# EAGLE design lcd (EAGLE 5.12)
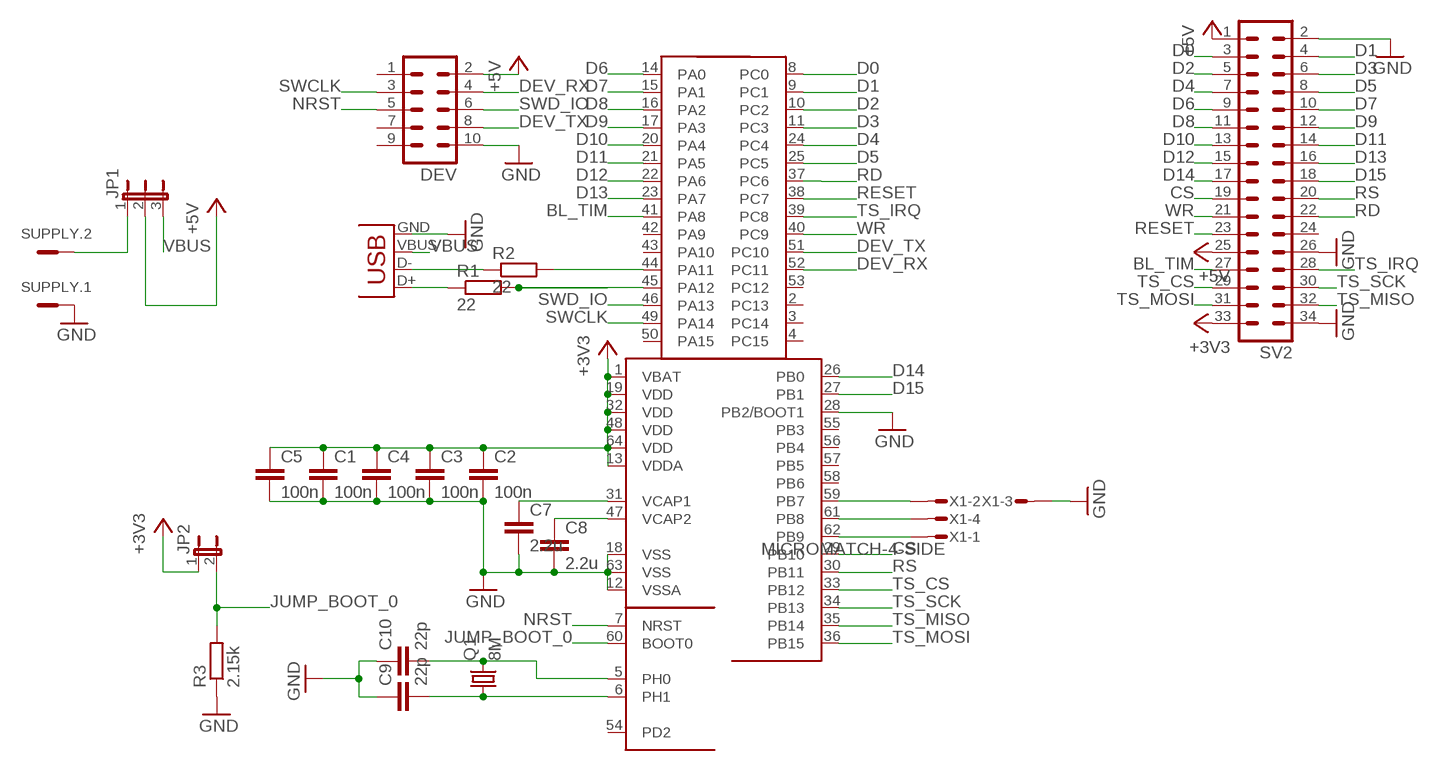
[diagram p0: schematic, sheet 1]

## Parts
C1  100n  C-EUC0603  [C0603]
C2  100n  C-EUC0603  [C0603]
C3  100n  C-EUC0603  [C0603]
C4  100n  C-EUC0603  [C0603]
C5  100n  C-EUC0603  [C0603]
C7  2.2u  C-EUC0603  [C0603]
C8  2.2u  C-EUC0603  [C0603]
C9  22p  C-EUC0603  [C0603]
C10  22p  C-EUC0603  [C0603]
DEV  ML10L  [ML10L]
JP1  JP2E  [JP2]
JP2  JP1E  [JP1]
Q1  8M  QUARTZABM7  [ABM7]
R1  22  R-EU_R0603  [R0603]
R2  22  R-EU_R0603  [R0603]
R3  2.15k  R-EU_R0603  [R0603]
SUPPLY  MC2  [MC2]
SV2  MA17-2  [MA17-2]
U1  STM32F4-64-8MIL  [SQFP-S-10X10-64-8MIL]
X1  MICROMATCH-4-SIDE  [MICROMATCH-4-SIDE]
X2  USB-MICROB-S  [USB-MICROB]

## Nets
+3V3: C1.1 C2.1 C3.1 C4.1 C5.1 JP2.1 SV2.33 U1.1(VBAT) U1.13(VDDA) U1.19(VDD) U1.32(VDD) U1.48(VDD) U1.64(VDD)
+5V: DEV.2 JP1.2 SV2.1 SV2.25
BL_TIM: SV2.27 U1.41(PA8)
CS: SV2.19 U1.29(PB10)
D0: SV2.3 U1.8(PC0)
D1: SV2.4 U1.9(PC1)
D2: SV2.5 U1.10(PC2)
D3: SV2.6 U1.11(PC3)
D4: SV2.7 U1.24(PC4)
D5: SV2.8 U1.25(PC5)
D6: SV2.9 U1.14(PA0)
D7: SV2.10 U1.15(PA1)
D8: SV2.11 U1.16(PA2)
D9: SV2.12 U1.17(PA3)
D10: SV2.13 U1.20(PA4)
D11: SV2.14 U1.21(PA5)
D12: SV2.15 U1.22(PA6)
D13: SV2.16 U1.23(PA7)
D14: SV2.17 U1.26(PB0)
D15: SV2.18 U1.27(PB1)
DEV_RX: DEV.4 U1.52(PC11)
DEV_TX: DEV.8 U1.51(PC10)
GND: C1.2 C2.2 C3.2 C4.2 C5.2 C7.2 C8.2 C9.1 C10.1 DEV.10 R3.1 SUPPLY.1 SV2.2 SV2.26 SV2.34 U1.12(VSSA) U1.18(VSS) U1.28(PB2/BOOT1) U1.63(VSS) X1.3 X2.GND
JUMP_BOOT_0: JP2.2 R3.2 U1.60(BOOT0)
N$1: U1.62(PB9) X1.1
N$2: C7.1 U1.31(VCAP1)
N$3: C8.1 U1.47(VCAP2)
N$4: C10.2 Q1.2 U1.5(PH0)
N$5: C9.2 Q1.1 U1.6(PH1)
N$6: U1.61(PB8) X1.4
N$7: U1.59(PB7) X1.2
N$8: R1.1 X2.D+
N$9: R2.1 X2.D-
N$10: JP1.1 SUPPLY.2
NRST: DEV.5 U1.7(NRST)
RD: SV2.22 U1.37(PC6)
RESET: SV2.23 U1.38(PC7)
RS: SV2.20 U1.30(PB11)
SWCLK: DEV.3 U1.49(PA14)
SWD_IO: DEV.6 U1.46(PA13)
TS_CS: SV2.29 U1.33(PB12)
TS_IRQ: SV2.28 U1.39(PC8)
TS_MISO: SV2.32 U1.35(PB14)
TS_MOSI: SV2.31 U1.36(PB15)
TS_SCK: SV2.30 U1.34(PB13)
USB_DM: R2.2 U1.44(PA11)
USB_DP: R1.2 U1.45(PA12)
VBUS: JP1.3 X2.VBUS
WR: SV2.21 U1.40(PC9)
Unconnected: DEV.1 DEV.7 DEV.9 SV2.24 U1.2(PC13) U1.3(PC14) U1.4(PC15) U1.42(PA9) U1.43(PA10) U1.50(PA15) U1.53(PC12) U1.54(PD2) U1.55(PB3) U1.56(PB4) U1.57(PB5) U1.58(PB6)

## Library data of the parts
C1-C5 C7-C10 = rcl:C-EU: CAPACITOR, European symbol
DEV = con-harting-ml:ML10: HARTING
JP1 = jumper:JP2E: JUMPER
JP2 = jumper:JP1E: JUMPER
Q1 = ni-crystal:QUARTZ
R1-R3 = rcl:R-EU_: RESISTOR, European symbol
SUPPLY = con-phoenix-381_l:MC2: Mini-Combicon 3.81mm horizontal 2-polig MC 1,5/2-G-3,81 Artikel-Nr. 1803277
SV2 = con-lstb:MA17-2: PIN HEADER
U1 = apbteam_stm32:STM32F4-64: STM32F4, 64 pin package According to STM32F40x datasheet, compatible with STM32F4xx, STM32F2xx. Also compatible with STM32F10x, if VCAP1 and VCAP2 are connected directly to VSS.
X1 = apbteam_con-amp-micromatch:MICROMATCH-4: MicroMaTch 4
X2 = apbteam_con-usb:USB: USB Connectors

## Board
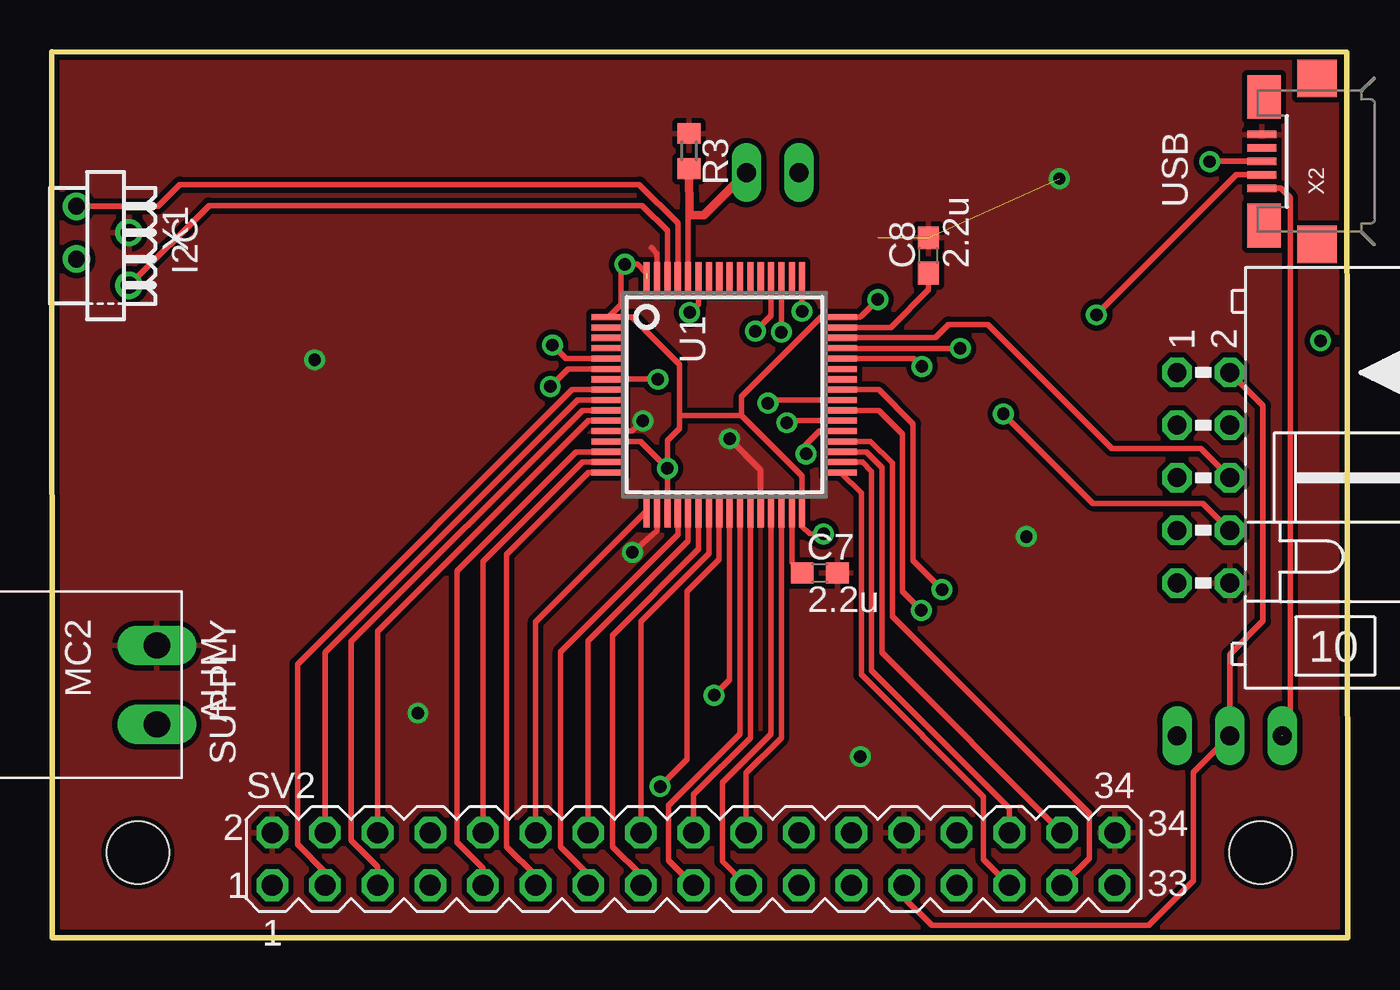
[diagram p1: board, top side]
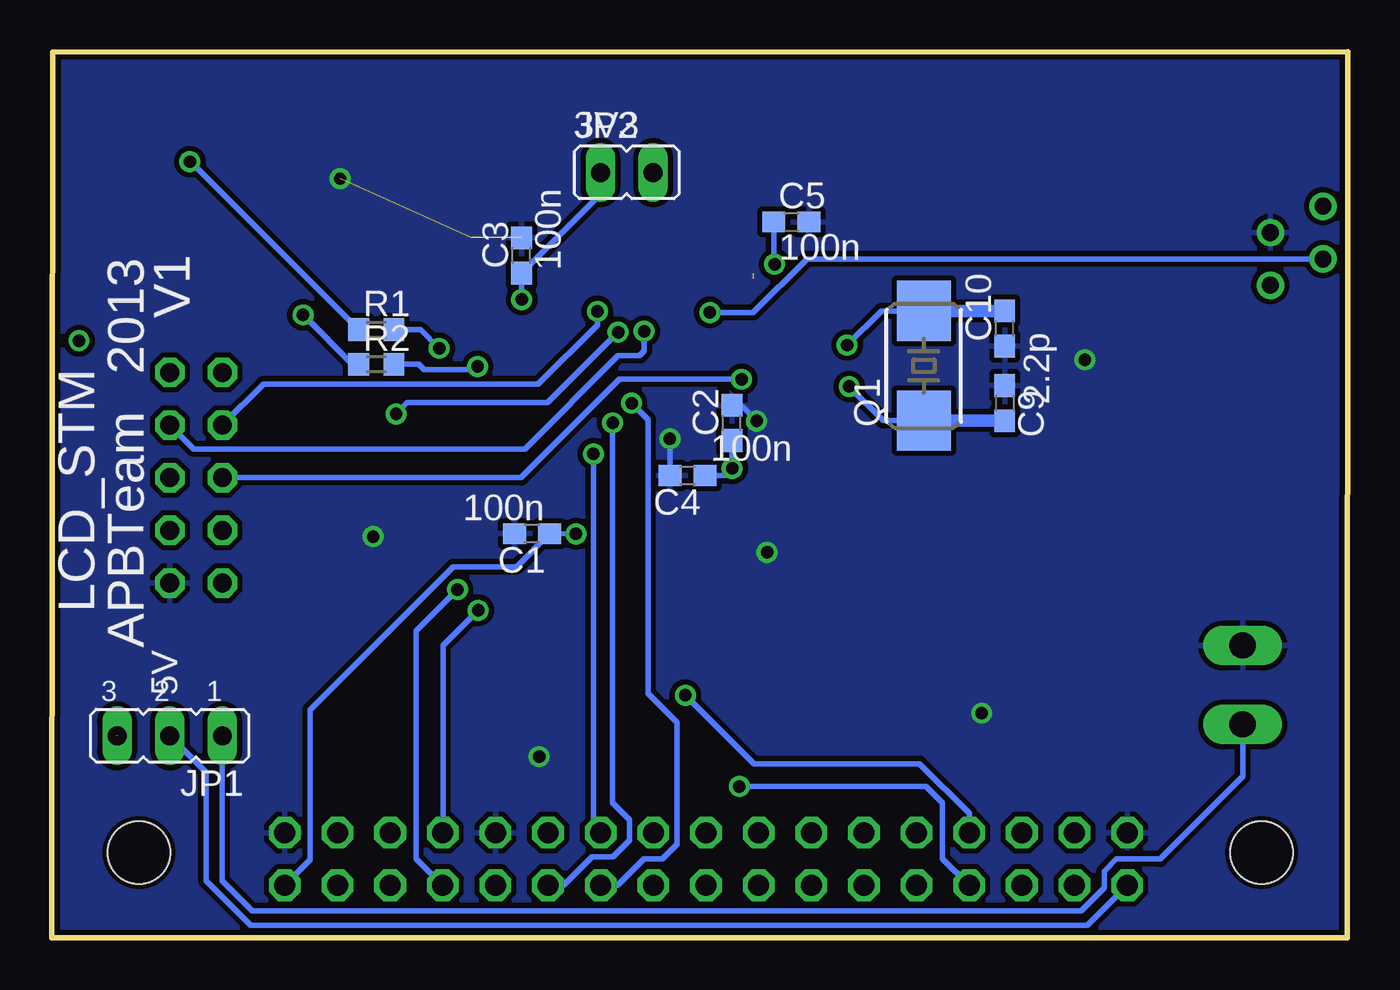
[diagram p2: board, bottom side, seen from below]

Size 62.52 x 42.76 mm. Coordinates in mm from the lower left corner, seen from the top.
Outline: 62.52,0.01 0.03,0 0,42.76 62.47,42.75 62.52,0.01
Copper layers (1*16): Top 0.035mm / dielectric 1.5mm / Bottom 0.035mm
Design rules "Dipole-electronique": minimum track width 0.2mm, minimum drill 0.5mm, track to track 0.2mm, track to pad 0.2mm, pad to pad 0.2mm, via to via 0.2mm, smd to smd 0.2mm, copper to edge 0.2mm, drill to drill 8mil, minimum pad ring 10mil, minimum via ring 8mil, stop-mask expansion 4mil, vias tented up to drill 0mil, thermal gap 10mil
Holes 3 mm at 4.16,4.12 58.32,4.12

### Footprints (pad centres in the part's own frame; a part is rotated, then mirrored left to right if it is on the bottom)
C0603 = smd 1.1 x 1: 1 -0.85,0; 2 0.85,0
ML10L = drill 0.914 octagon: 1 -5.08,-1.27; 2 -5.08,1.27; 3 -2.54,-1.27; 4 -2.54,1.27; 5 0,-1.27; 6 0,1.27; 7 2.54,-1.27; 8 2.54,1.27; 9 5.08,-1.27; 10 5.08,1.27
JP2 = drill 0.914 long: 1 -2.54,0; 2 0,0; 3 2.54,0
JP1 = drill 0.914 long: 1 0,-1.27; 2 0,1.27
ABM7 = smd 2.9 x 2.6: 1 -2.65,0; 2 2.65,0
R0603 = smd 1 x 1.1: 1 -0.85,0; 2 0.85,0
MC2 = drill 1.27 long: 1 -1.905,0; 2 1.905,0
MA17-2 = drill 1.016 octagon: 1 -20.32,-1.27; 2 -20.32,1.27; 3 -17.78,-1.27; 4 -17.78,1.27; 5 -15.24,-1.27; 6 -15.24,1.27; 7 -12.7,-1.27; 8 -12.7,1.27; 9 -10.16,-1.27; 10 -10.16,1.27; 11 -7.62,-1.27; 12 -7.62,1.27; 13 -5.08,-1.27; 14 -5.08,1.27; 15 -2.54,-1.27; 16 -2.54,1.27; 17 0,-1.27; 18 0,1.27; 19 2.54,-1.27; 20 2.54,1.27; 21 5.08,-1.27; 22 5.08,1.27; 23 7.62,-1.27; 24 7.62,1.27; 25 10.16,-1.27; 26 10.16,1.27; 27 12.7,-1.27; 28 12.7,1.27; 29 15.24,-1.27; 30 15.24,1.27; 31 17.78,-1.27; 32 17.78,1.27; 33 20.32,-1.27; 34 20.32,1.27
SQFP-S-10X10-64-8MIL = smd 0.295 x 1.6: 1 -3.75,-5.6; 2 -3.25,-5.6; 3 -2.75,-5.6; 4 -2.25,-5.6; 5 -1.75,-5.6; 6 -1.25,-5.6; 7 -0.75,-5.6; 8 -0.25,-5.6; 9 0.25,-5.6; 10 0.75,-5.6; 11 1.25,-5.6; 12 1.75,-5.6; 13 2.25,-5.6; 14 2.75,-5.6; 15 3.25,-5.6; 16 3.75,-5.6; 33 3.75,5.6; 34 3.25,5.6; 35 2.75,5.6; 36 2.25,5.6; 37 1.75,5.6; 38 1.25,5.6; 39 0.75,5.6; 40 0.25,5.6; 41 -0.25,5.6; 42 -0.75,5.6; 43 -1.25,5.6; 44 -1.75,5.6; 45 -2.25,5.6; 46 -2.75,5.6; 47 -3.25,5.6; 48 -3.75,5.6 | smd 1.6 x 0.295: 17 5.6,-3.75; 18 5.6,-3.25; 19 5.6,-2.75; 20 5.6,-2.25; 21 5.6,-1.75; 22 5.6,-1.25; 23 5.6,-0.75; 24 5.6,-0.25; 25 5.6,0.25; 26 5.6,0.75; 27 5.6,1.25; 28 5.6,1.75; 29 5.6,2.25; 30 5.6,2.75; 31 5.6,3.25; 32 5.6,3.75; 49 -5.6,3.75; 50 -5.6,3.25; 51 -5.6,2.75; 52 -5.6,2.25; 53 -5.6,1.75; 54 -5.6,1.25; 55 -5.6,0.75; 56 -5.6,0.25; 57 -5.6,-0.25; 58 -5.6,-0.75; 59 -5.6,-1.25; 60 -5.6,-1.75; 61 -5.6,-2.25; 62 -5.6,-2.75; 63 -5.6,-3.25; 64 -5.6,-3.75
MICROMATCH-4-SIDE = drill 0.813 round: 1 1.905,1.27; 2 0.635,-1.27; 3 -0.635,1.27; 4 -1.905,-1.27
USB-MICROB = smd 0.35 x 1.4: D+ 0,2.65; D- -0.65,2.65; GND 1.3,2.65; ID 0.65,2.65; VBUS -1.3,2.65 | smd 1.8 x 1.9: MT1 -4,0; MT2 4,0 | smd 2.1 x 1.6: MT3 -3.1,2.55; MT4 3.1,2.55

### Placement (x,y rotation side)
C1  39.35,19.51 180 bottom
C2  29.71,24.85 90 bottom
C3  39.86,32.93 90 bottom
C4  31.85,22.31 180 bottom
C5  26.84,34.55 0 bottom
C7  37.05,17.61 0 top
C8  42.3,32.93 90 top
C9  16.55,25.81 270 bottom
C10  16.55,29.41 90 bottom
DEV  55.56,22.21 270 top
JP1  56.83,9.76 180 bottom
JP2  34.78,36.94 270 bottom
Q1  20.45,27.61 90 bottom
R1  46.87,29.35 0 bottom
R2  46.87,27.68 0 bottom
R3  30.74,37.97 270 top
SUPPLY  5.07,12.21 270 top
SV2  30.96,3.81 0 top
U1  32.45,26.21 270 top
X1  2.46,33.4 270 top
X2  61.04,37.47 90 top

### Tracks (layer width: path | path; a pad name or v marks a point on that pad's centre or on a via)
+3V3  (via drill 0.6)  (1 unrouted)
  Top 0.254: 28.7,32.06 28.25,32.51 v27.65,32.51 27.45,32.51 27.45,30.56 U1.1 | U1.1 26.6,29.96 | 39.05,30.01 v39.85,30.81 39,29.96 U1.48 37.11,29.95 33.28,26.12 33.28,25.21 | U1.19 v29.7,22.66 | v37.23,19.5 36.55,19.51 36.2,19.86 U1.32 36.2,22.29 33.28,25.21 | U1.13 28.4,23.96 v29.7,22.66 | v29.7,22.66 C2.1 30.29,24.59 30.29,25.21 | 30.29,25.21 30.29,27.67 28,29.96 U1.1 | 30.29,25.21 33.28,25.21
  Bottom 0.254: SV2.33 50.05,3.77 50.05,11.01 43.15,17.91 40.1,17.91 C1.1 v37.23,19.5 | v27.65,32.51 27.69,32.55 C5.1 | v39.85,30.81 v39.86,30.82 C3.1 36.05,35.89 JP2.1 | C2.1 29.7,24.31 v29.7,22.66 30.05,22.31 C4.1
+5V
  Top 0.254: SV2.25 41.12,1.94 42.45,0.61 52.93,0.61 55.07,2.75 55.07,8 JP1.2 56.83,13.69 58.43,15.29 58.43,25.69 DEV.2
  Bottom 0.254: SV2.1 12.57,0.61 52.93,0.61 55.07,2.75 55.07,8 JP1.2
BL_TIM  (via drill 0.6)
  Top 0.254: U1.41 39.9,26.46 41.55,24.81 41.55,18.21 v42.95,16.81
  Bottom 0.254: SV2.27 44.95,3.83 44.95,14.81 v42.95,16.81
CS
  Top 0.254: SV2.19 32.35,3.69 32.35,7.51 34.7,9.86 U1.29
D0
  Top 0.254: SV2.3 13.18,3.18 11.85,4.51 11.85,13.21 25.1,26.46 U1.8
D1
  Top 0.254: SV2.4 13.18,13.78 25.36,25.96 U1.9
D2
  Top 0.254: SV2.5 15.72,3.44 14.45,4.71 14.45,14.31 25.6,25.46 U1.10
D3
  Top 0.254: SV2.6 15.72,14.78 25.9,24.96 U1.11
D4  (via drill 0.6)
  Top 0.254: v29.35,7.31 30.65,8.61 30.65,16.71 32.2,18.26 U1.24
  Bottom 0.254: SV2.7 19.55,3.83 19.55,6.51 20.35,7.31 v29.35,7.31
D5  (via drill 0.6)
  Top 0.254: v31.95,11.71 32.7,12.46 U1.25
  Bottom 0.254: SV2.8 18.26,6.02 20.65,8.41 28.65,8.41 v31.95,11.71
D6
  Top 0.254: SV2.9 20.8,3.36 19.55,4.61 19.55,17.71 25.3,23.46 U1.14
D7
  Top 0.254: SV2.10 20.8,18.16 25.6,22.96 U1.15
D8
  Top 0.254: SV2.11 23.34,3.02 21.95,4.41 21.95,18.51 25.9,22.46 U1.16
D9
  Top 0.254: SV2.12 23.34,15.25 U1.17
D10
  Top 0.254: SV2.13 25.88,3.08 24.55,4.41 24.55,13.81 30.2,19.46 U1.20
D11
  Top 0.254: SV2.14 25.88,14.34 30.7,19.16 U1.21
D12
  Top 0.254: SV2.15 28.42,3.04 27.05,4.41 27.05,14.61 31.2,18.76 U1.22
D13
  Top 0.254: SV2.16 28.42,15.28 31.7,18.56 U1.23
D14
  Top 0.254: SV2.17 29.75,3.75 29.75,6.41 33.2,9.86 U1.26
D15
  Top 0.254: SV2.18 30.96,6.92 33.7,9.66 U1.27
DEV_RX  (via drill 0.6)
  Top 0.254: U1.52 34.7,30.04 v33.94,29.28
  Bottom 0.254: v33.94,29.28 33.94,28.32 34.16,28.1 35.2,28.1 39.7,23.6 55.68,23.6 DEV.4
DEV_TX  (via drill 0.6)
  Top 0.254: v35.2,29.23 U1.51 | v45.91,25.29 50.23,20.97 55.53,20.97 DEV.8
  Bottom 0.254: v35.2,29.23 38.6,25.83 45.37,25.83 v45.91,25.29
GND  (via drill 0.6)  (2 unrouted)
  Top 0.254: U1.28 34.2,22.59 v32.7,24.09 | U1.63 29.2,33.03 28.93,33.3 | U1.12 28,24.46 v28.52,24.95 | U1.18 29.2,19.66 v28.01,18.61
  Bottom 0.254: C4.2 v32.7,24.09 | v28.52,24.95 29.24,25.7 C2.2
  other vias: 12.68,27.9 17.66,10.85 39.01,8.75 47.02,19.37 48.61,36.64
  pour Bottom (isolate 0.254): 62.45,42.72 -0.01,42.79 0.05,0.01 62.47,0.04
  pour Top (isolate 0.254): 62.45,-0.01 0.05,0.01 0,42.79 62.48,42.76
JUMP_BOOT_0
  Top 0.254: R3.2 30.7,34.88 U1.60
  Top 0.406: R3.2 30.77,34.88 31.45,34.88 JP2.2
N$1
  Top 0.254: U1.62 29.7,34.13 28.48,35.34 7.58,35.34 X1.1
N$2
  Top 0.254: C7.1 35.7,18.11 U1.31
N$3
  Top 0.254: C8.1 42.3,31.28 40.48,29.46 U1.47
N$4  (via drill 0.6)
  Top 0.254: 24.75,28.01 v24.15,28.61 24.8,27.96 U1.5
  Bottom 0.254: Q1.2 22.5,30.26 v24.15,28.61
  Bottom 0.61: C10.2 Q1.2
N$5  (via drill 0.6)
  Top 0.254: 24.75,27.31 v24.05,26.61 24.9,27.46 U1.6
  Bottom 0.254: Q1.1 22.4,24.96 v24.05,26.61
  Bottom 0.61: C9.2 Q1.1
N$6
  Top 0.254: U1.61 30.2,34.5 28.34,36.36 6.18,36.36 5.12,35.3 X1.4
N$7  (via drill 0.6)
  Top 0.254: v30.77,30.18 30.79,30.18 31.2,30.59 U1.59
  Bottom 0.254: v30.77,30.18 28.68,30.18 26.1,32.77 X1.2
N$8  (via drill 0.6)
  Top 0.254: v55.86,37.46 55.87,37.47 X2.D+
  Bottom 0.254: R1.1 55.83,37.46 v55.86,37.46
N$9  (via drill 0.6)
  Top 0.254: X2.D- 57.15,36.82 v50.4,30.07
  Bottom 0.254: v50.4,30.07 47.91,27.58 R2.1
N$10
  Bottom 0.254: JP1.1 54.29,2.75 52.85,1.31 12.85,1.31 11.75,2.41 11.75,3.21 11.15,3.81 9.05,3.81 5.07,7.79 SUPPLY.2
N$16  (via drill 0.6)
  other vias: 61.21,28.82
NRST  (via drill 0.6)
  Top 0.254: U1.7 v29.24,26.96
  Bottom 0.254: v29.24,26.96 35.13,26.96 39.51,22.58 39.87,22.22 39.88,22.21 DEV.5
RD  (via drill 0.6)
  Top 0.254: U1.37 37.03,24.46 36.39,23.82 v36.39,23.36
  Bottom 0.254: SV2.22 36.39,5.43 v36.39,23.36
RESET  (via drill 0.6)
  Top 0.254: U1.38 35.56,24.96 v35.46,24.86
  Bottom 0.254: SV2.23 37.82,2.54 36.45,3.91 35.45,3.91 34.65,4.71 34.65,5.7 35.46,6.51 v35.46,24.86
RS
  Top 0.254: SV2.20 33.5,7.96 35.2,9.66 U1.30
SWCLK  (via drill 0.6)
  Top 0.254: v36.2,30.24 U1.49
  Bottom 0.254: v36.2,30.24 36.2,29.58 39.05,26.73 52.31,26.73 DEV.3
SWD_IO
  Top 0.254: DEV.6 55.43,23.61 51.15,23.61 45.16,29.6 43.26,29.6 42.62,28.96 U1.46
TS_CS
  Top 0.254: SV2.29 44.95,3.79 44.95,6.81 39.05,12.71 39.05,21.46 U1.33
TS_IRQ  (via drill 0.6)
  Top 0.254: v41.95,15.81 41.05,16.71 41.05,24.31 39.9,25.46 U1.39
  Bottom 0.254: SV2.28 43.65,14.11 v41.95,15.81
TS_MISO
  Top 0.254: SV2.32 40.05,13.77 40.05,22.71 39.3,23.46 U1.35
TS_MOSI
  Top 0.254: SV2.31 50.05,3.85 50.05,6.01 40.55,15.51 40.55,16.41 40.55,16.91 40.55,22.91 39.5,23.96 U1.36
TS_SCK
  Top 0.254: SV2.30 46.2,6.26 39.55,12.91 39.55,22.51 39.1,22.96 U1.34
USB_DM  (via drill 0.6)
  Top 0.254: U1.44 41.6,27.96 v41.98,27.58 42,27.56
  Bottom 0.254: R2.2 44.83,27.69 44.56,27.42 42.14,27.42 v41.98,27.58
USB_DP  (via drill 0.6)
  Top 0.254: v43.83,28.45 U1.45
  Bottom 0.254: R1.2 44.73,29.35 v43.83,28.45
VBUS  (1 unrouted)
  Top 0.254: JP1.3 59.74,10.15 59.74,35.72 59.29,36.17 X2.VBUS
WR  (via drill 0.6)
  Top 0.254: U1.40 34.7,25.96 v34.55,25.81
  Bottom 0.254: SV2.21 35.22,2.54 33.95,3.81 33.05,3.81 32.35,4.51 32.35,10.41 33.75,11.81 33.75,25.01 33.8,25.06 v34.55,25.81

### Text on the board
tSilk: USB | I2C | 2.2u | 2.2u | ALIM | 2 | 34 | 1 | 33
bSilk: 3V3 | 100n | 2013 | 100n | V1 | 2.2p | APBTeam | 100n | 100n | LCD_STM | 5V